# EAGLE schematic mainBoard (EAGLE 6.0)
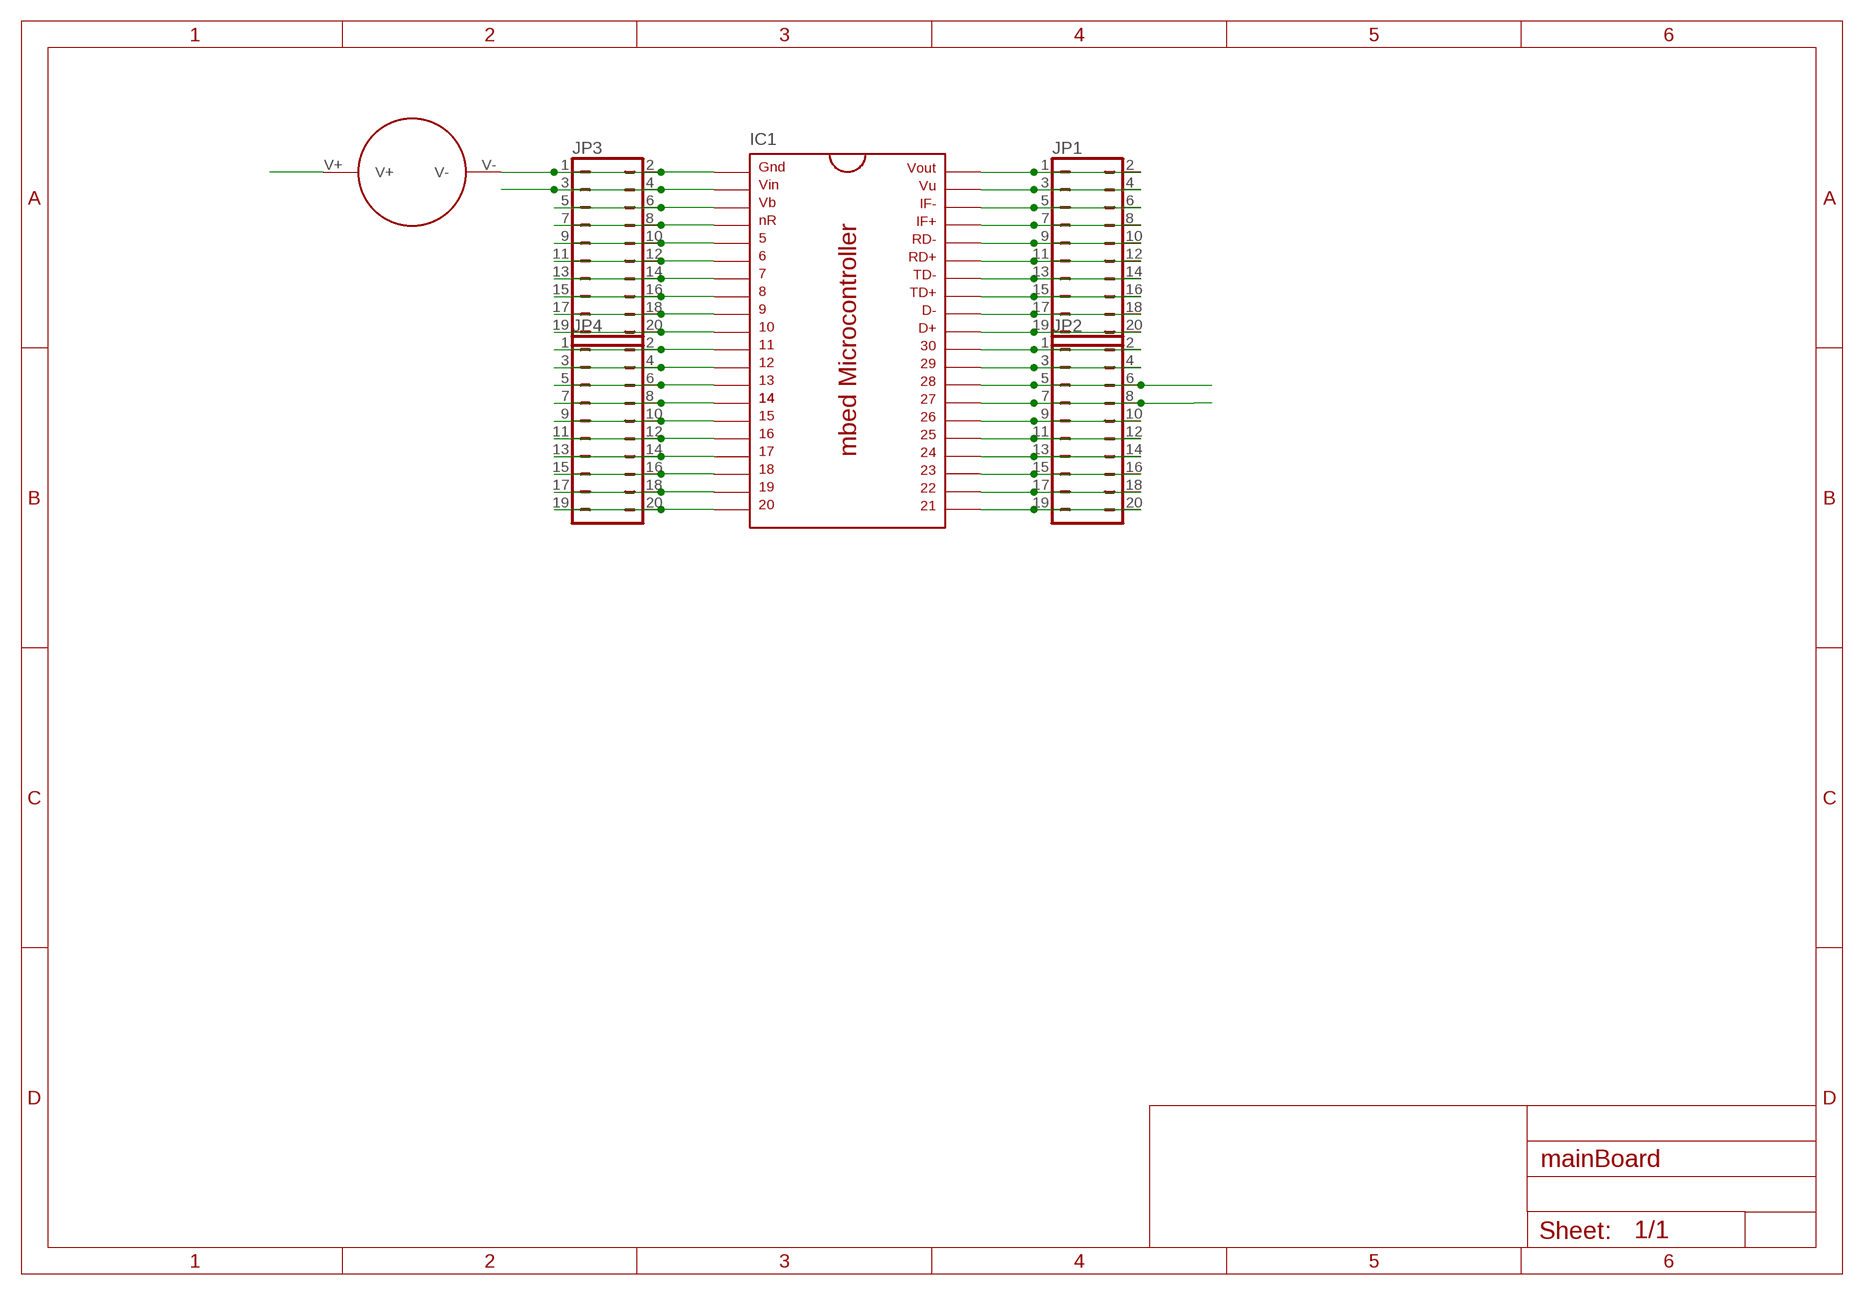
[diagram p0: schematic, sheet 1]

## Parts
IC1  MBED_MICROCONTROLLER  [DIL40_0.9]
JP1  JP10Q  [JP10Q]
JP2  JP10Q  [JP10Q]
JP3  JP10Q  [JP10Q]
JP4  JP10Q  [JP10Q]
U$1  PANASONIC_BATTERYTHROUGH_HOLE  [PANASONIC_BATTERY]

## Nets
N$1: IC1.1 JP3.1 JP3.2 U$1.V-
N$3: IC1.40 JP1.1 JP1.2
N$4: IC1.39 JP1.3 JP1.4
N$5: IC1.38 JP1.5 JP1.6
N$6: IC1.37 JP1.7 JP1.8
N$7: IC1.36 JP1.9 JP1.10
N$8: IC1.35 JP1.11 JP1.12
N$9: IC1.34 JP1.13 JP1.14
N$10: IC1.33 JP1.15 JP1.16
N$11: IC1.32 JP1.17 JP1.18
N$12: IC1.31 JP1.19 JP1.20
N$13: IC1.30 JP2.1 JP2.2
N$14: IC1.29 JP2.3 JP2.4
N$17: IC1.26 JP2.9 JP2.10
N$18: IC1.25 JP2.11 JP2.12
N$19: IC1.24 JP2.13 JP2.14
N$20: IC1.23 JP2.15 JP2.16
N$21: IC1.22 JP2.17 JP2.18
N$22: IC1.21 JP2.19 JP2.20
N$24: IC1.4 JP3.7 JP3.8
N$25: IC1.5 JP3.9 JP3.10
N$26: IC1.6 JP3.11 JP3.12
N$27: IC1.7 JP3.13 JP3.14
N$28: IC1.8 JP3.15 JP3.16
N$29: IC1.9 JP3.17 JP3.18
N$30: IC1.10 JP3.19 JP3.20
N$31: IC1.11 JP4.1 JP4.2
N$32: IC1.12 JP4.3 JP4.4
N$33: IC1.13 JP4.5 JP4.6
N$34: IC1.14 JP4.7 JP4.8
N$35: IC1.15 JP4.9 JP4.10
N$36: IC1.16 JP4.11 JP4.12
N$37: IC1.17 JP4.13 JP4.14
N$38: IC1.18 JP4.15 JP4.16
N$39: IC1.19 JP4.17 JP4.18
N$40: IC1.20 JP4.19 JP4.20
SCL: IC1.27 JP2.7 JP2.8
SDA: IC1.28 JP2.5 JP2.6
VB: IC1.3 JP3.5 JP3.6 U$1.V+
VIN: IC1.2 JP3.3 JP3.4

## Library data of the parts
IC1 = mbed-microcontroller:MBED_MICROCONTROLLER: mbed Microcontroller, DIP40, 0.9"
JP1-JP4 = jumper:JP10Q: JUMPER
U$1 = DataloggingTestLib:PANASONIC_BATTERY